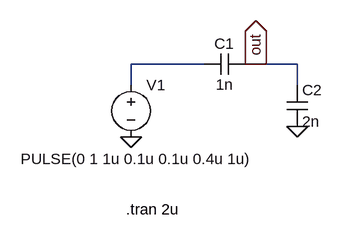
[diagram p0: schematic question13.asc]
question13.asc, the LTspice schematic file:
Version 4
SHEET 1 880 680
WIRE 160 96 48 96
WIRE 240 96 224 96
WIRE 304 96 240 96
WIRE 48 128 48 96
WIRE 304 128 304 96
FLAG 48 208 0
FLAG 304 192 0
FLAG 240 96 out
IOPIN 240 96 Out
SYMBOL voltage 48 112 R0
WINDOW 3 -170 130 Left 2
WINDOW 123 0 0 Left 0
WINDOW 39 0 0 Left 0
SYMATTR Value PULSE(0 1 1u 0.1u 0.1u 0.4u 1u)
SYMATTR InstName V1
SYMBOL cap 224 80 R90
WINDOW 0 0 32 VBottom 2
WINDOW 3 32 32 VTop 2
SYMATTR InstName C1
SYMATTR Value 1n
SYMBOL cap 288 128 R0
SYMATTR InstName C2
SYMATTR Value 2n
TEXT 40 320 Left 2 !.tran 2u

The netlist it stands for:
* question13.asc
V1 N001 0 PULSE(0 1 1u 0.1u 0.1u 0.4u 1u)
C1 out N001 1n
C2 out 0 2n
.tran 2u
.backanno
.end